# EAGLE design what-the-frequency-mk-1 (EAGLE 6.4)
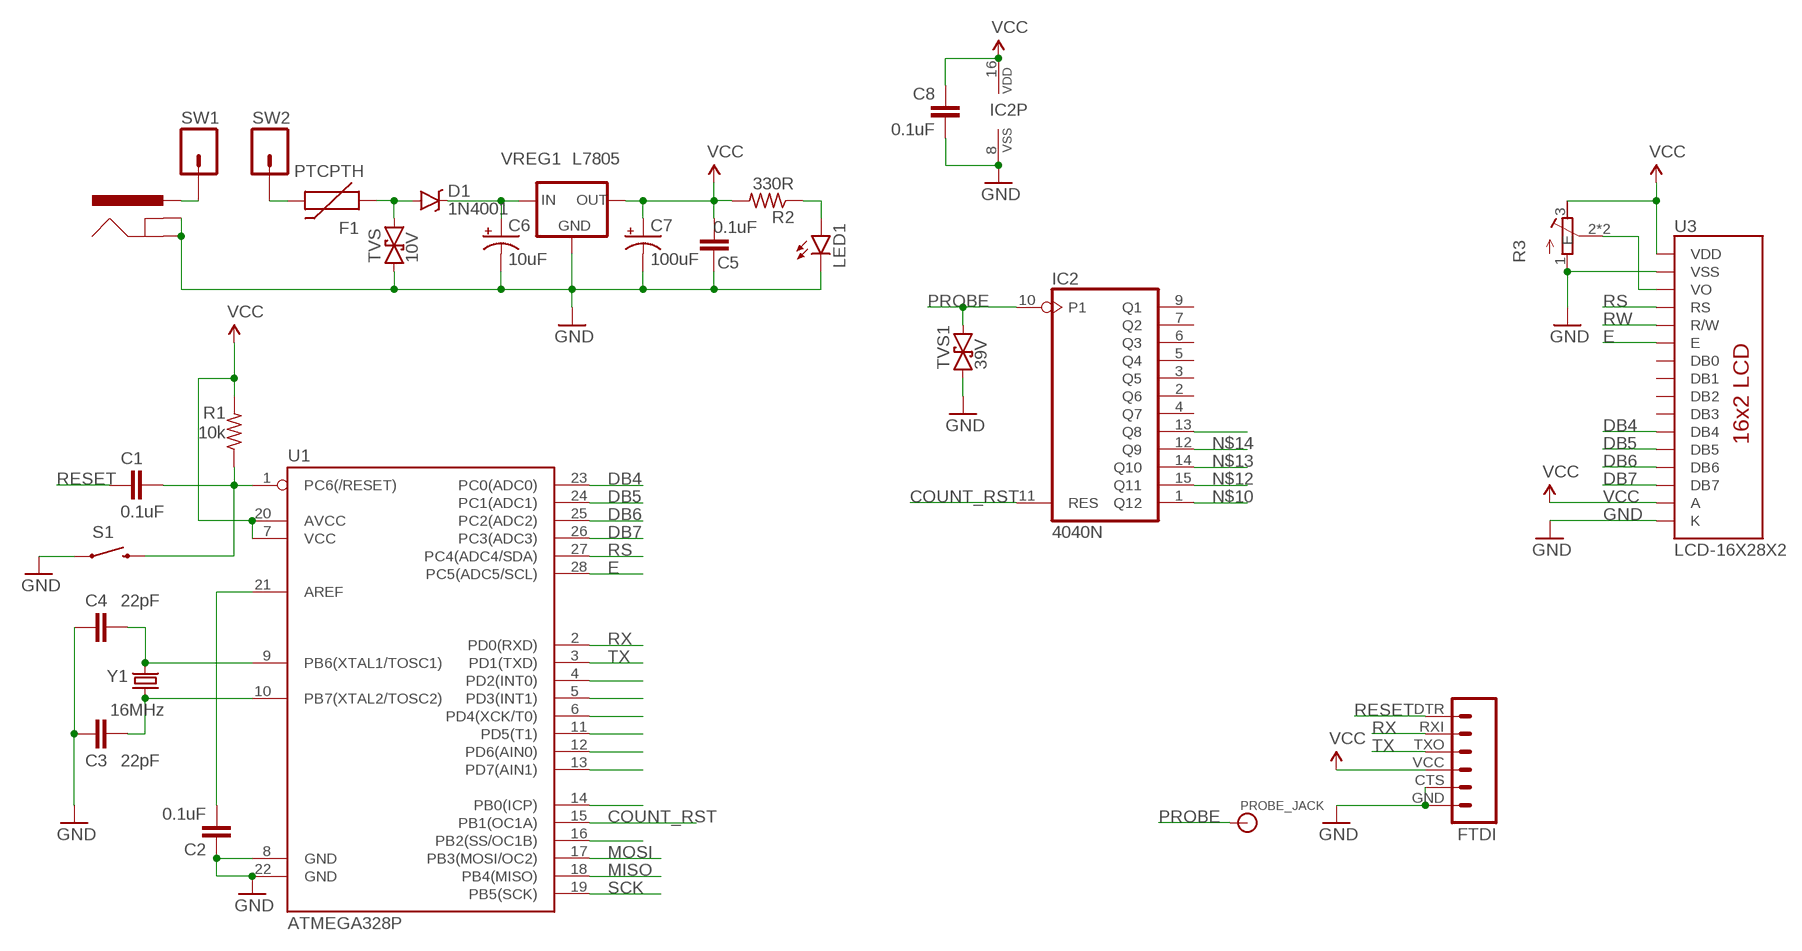
[diagram p0: schematic, sheet 1]

## Parts
C1  0.1uF  CAPACITOR-CERAMIC025-024X044  [C025-024X044]
C2  0.1uF  CAPACITOR-CERAMIC025-024X044  [C025-024X044]
C3  22pF  CAPACITOR-CERAMIC025-024X044  [C025-024X044]
C4  22pF  CAPACITOR-CERAMIC025-024X044  [C025-024X044]
C5  0.1uF  CAPACITOR-CERAMIC025-024X044  [C025-024X044]
C6  10uF  CAPACITOR-POLARIZEDE2.5-5  [E2,5-5]
C7  100uF  CAPACITOR-POLARIZEDE2.5-5  [E2,5-5]
C8  0.1uF  CAPACITOR-CERAMIC025-024X044  [C025-024X044]
D1  1N4001  DIODE-SCHOTTKYDO-41  [DO-41]
F1  PTCPTH  [PTC]
FTDI  FTDI_BASICPTH-TINY-TEXT  [FTDI_TINY_TXT]
IC2  4040N  [DIL16]
J2  POWER_JACKPTH  [POWER_JACK_PTH]
LED1  LED3MM  [LED3MM]
PROBE_JACK  BANANA_CONNPTH-RA  [BANANA-PTH-RA-SAFEWORD]
R1  10k  RESISTORPTH-AXIAL-5.08MM  [AXIAL-PTH-5.08MM]
R2  330R  RESISTORPTH-AXIAL-5.08MM  [AXIAL-PTH-5.08MM]
R3  POTENTIOMETERTHUMBWHEEL-16MM  [POT-THUMBWHEEL]
S1  SWITCH-MOMENTARY-2PTH-RA  [TACTILE-PTH-SIDE]
SW1  M01PTH_2MM  [1X01_2MM]
SW2  M01PTH_2MM  [1X01_2MM]
TVS  10V  TVSDO-41-TVS-BIDIRECTIONAL  [DO-41-TVS]
TVS1  39V  TVSDO-41-TVS-BIDIRECTIONAL  [DO-41-TVS]
U1  ATMEGA328P  ATMEGA328P_PDIP  [DIL28-3]
U3  LCD-16X28X2  [LCD-8X2]
VREG1  L7805  V_REG_78XXTO-92-INLINE  [TO-92-AMMO]
Y1  16MHz  CRYSTALHC49UV  [HC49U-V]

## Nets
COUNT_RST: IC2.11(RES) U1.15(PB1(OC1A))
DB4: U1.23(PC0(ADC0)) U3.11(DB4)
DB5: U1.24(PC1(ADC1)) U3.12(DB5)
DB6: U1.25(PC2(ADC2)) U3.13(DB6)
DB7: U1.26(PC3(ADC3)) U3.14(DB7)
E: U1.28(PC5(ADC5/SCL)) U3.6(E)
GND: C2.1 C3.2 C4.2 C5.1 C6.- C7.- C8.1 FTDI.CTS FTDI.GND IC2.8(VSS) J2.GND J2.GNDBREAK LED1.K(C) R3.1(A) S1.1 TVS1.P$1 TVS.P$1 U1.8(GND) U1.22(GND) U3.1(VSS) U3.16(K) VREG1.2(GND)
MISO: U1.18(PB4(MISO))
MOSI: U1.17(PB3(MOSI/OC2))
N$1: C6.+ D1.C VREG1.1(IN)
N$2: LED1.A R2.P$1
N$3: J2.PWR SW1.1
N$4: D1.A F1.P$1 TVS.P$2
N$5: F1.P$2 SW2.1
N$6: C4.1 U1.9(PB6(XTAL1/TOSC1)) Y1.2
N$7: C3.1 U1.10(PB7(XTAL2/TOSC2)) Y1.1
N$8: C2.2 U1.21(AREF)
N$9: R3.2(S) R3.2@1(S) U3.3(VO)
N$10: IC2.1(Q12)
N$11: C1.2 R1.P$1 S1.2 U1.1(PC6(/RESET))
N$12: IC2.15(Q11)
N$13: IC2.14(Q10)
N$14: IC2.12(Q9)
N$15: IC2.13(Q8)
N$22: U1.4(PD2(INT0))
N$23: U1.5(PD3(INT1))
N$24: U1.6(PD4(XCK/T0))
N$25: U1.11(PD5(T1))
N$26: U1.12(PD6(AIN0))
N$27: U1.13(PD7(AIN1))
N$28: U1.14(PB0(ICP))
N$29: U1.16(PB2(SS/OC1B))
PROBE: IC2.10(P1) PROBE_JACK.P$1 PROBE_JACK.P$2 TVS1.P$2
RESET: C1.1 FTDI.DTR
RS: U1.27(PC4(ADC4/SDA)) U3.4(RS)
RW: U3.5(R/W)
RX: FTDI.RXI U1.2(PD0(RXD))
SCK: U1.19(PB5(SCK))
TX: FTDI.TXO U1.3(PD1(TXD))
VCC: C5.2 C7.+ C8.2 FTDI.VCC IC2.16(VDD) R1.P$2 R2.P$2 R3.3(E) U1.7(VCC) U1.20(AVCC) U3.2(VDD) U3.15(A) VREG1.3(OUT)
Unconnected: IC2.2(Q6) IC2.3(Q5) IC2.4(Q7) IC2.5(Q4) IC2.6(Q3) IC2.7(Q2) IC2.9(Q1) U3.7(DB0) U3.8(DB1) U3.9(DB2) U3.10(DB3)

## Library data of the parts
C1-C5 C8 = A_butts:CAPACITOR-CERAMIC: CAPACITOR, European symbol
C6 C7 = A_butts:CAPACITOR-POLARIZED: POLARIZED CAPACITOR, American symbol
D1 = A_butts:DIODE-SCHOTTKY: Schottky diodes in SFE's production catalog BAT20J 1A 23V 0.62Vf RB751 120mA 40V 0.37Vf PMEG4005EJ 0.5A 40V 0.42Vf MBRA140 1A 40V 0.5Vf B340A 3A 40V SMA
F1 = A_butts:PTC: Resettable Fuse PTC Resettable Fuse. Spark Fun Electronics SKU : COM-08357
FTDI = A_butts:FTDI_BASIC: FTDI Basic header with labels
IC2 = A_butts:4040: 12-stage binary/ripple COUNTER
J2 = SparkFun-Connectors:POWER_JACK: Power Jack This is the standard 5.5mm barrel jack for power. The PTH is the most common, proven, reliable, footprint. The Slot footprint only works if the mill layer is transmitted to the PCB fab house so be warned. Mating wall wart : TOL-00298 (and others); PROD_ID: PRT-00119
LED1 = A_butts:LED: LEDs Standard schematic elements and footprints for 5mm, 3mm, 1206, and 0603 sized LEDs. 5mm - Spark Fun Electronics SKU : COM-00529 (and others)
PROBE_JACK = A_butts:BANANA_CONN: Through-hole banana jack
R1 R2 = A_butts:RESISTOR: RESISTOR, American symbol
R3 = A_butts:POTENTIOMETER: Trimm resistor
S1 = A_butts:SWITCH-MOMENTARY-2: Various NO switches- pushbuttons, reed, etc
SW1 SW2 = A_butts:M01: Header 1 Standard 1-pin 0.1" header. Use with straight break away headers (SKU : PRT-00116), right angle break away headers (PRT-00553), swiss pins (PRT-00743), machine pins (PRT-00117), and female headers (PRT-00115).
TVS TVS1 = A_butts:TVS: Transient voltage suppressor- prevents ESD on inputs. Ignore package description- MBRA140 is NOT this type of part!!!
U1 = SparkFun-DigitalIC:ATMEGA328P_PDIP: uC used in the Arduino 32kb flash, 1k EEPROM, 2k SRAM This is the through-hole version of this chip.
U3 = A_butts:LCD-16X2: Standard text-only 16x2 parallel input LCD
VREG1 = A_butts:V_REG_78XX: Voltage Regulator Standard 7805 5V regulator. IGO (Input Ground Output). Spark Fun Electronics SKU : COM-00107
Y1 = SparkFun-FreqCtrl:CRYSTAL: Various standard crystals. Proven footprints. Spark Fun Electronics SKU : COM-00534

## Board
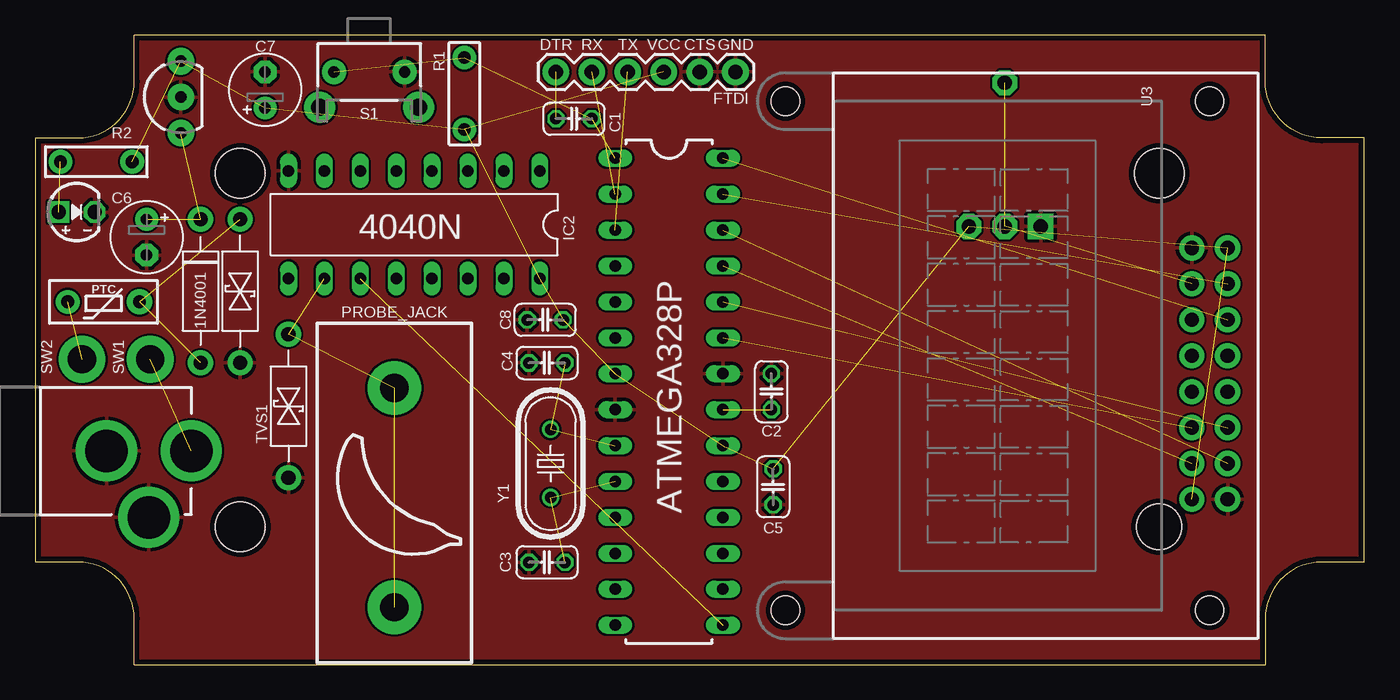
[diagram p1: board, top side]
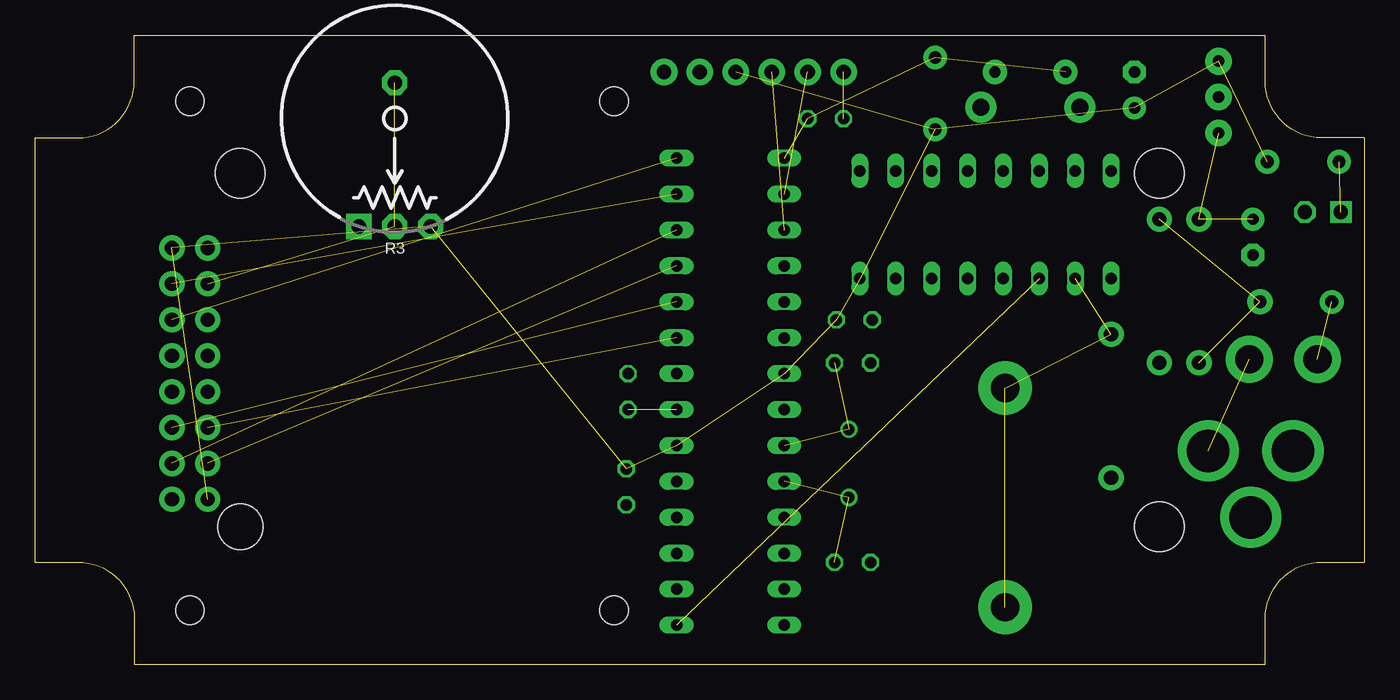
[diagram p2: board, bottom side, seen from below]

Size 94.01 x 44.5 mm. Coordinates in mm from the lower left corner, seen from the top.
Outline: 7,0 87.01,0 87.01,3.26 arc-90 91,7.25 94,7.25 94,37.25 91,37.25 arc-90 87.01,41.24 87.01,44.5 7,44.5 7,41.24 arc-90 3.01,37.25 0,37.25 0,7.25 3.01,7.25 arc-90 7,3.26 7,0
Copper layers (1*16): Top 0.0356mm / dielectric 1.5011mm / Bottom 0.0356mm
Design rules "LaenPCBOrder2": minimum track width 6mil, minimum drill 13mil, track to track 6mil, track to pad 6mil, pad to pad 6mil, via to via 6mil, smd to smd 6mil, copper to edge 15mil, drill to drill 6mil, minimum pad ring 7mil, minimum via ring 7mil, stop-mask expansion 3mil, vias tented up to drill 20mil, thermal gap 10mil
Holes 3.51 mm at 14.5,9.75 14.5,34.75 79.5,34.75
Holes 3.2 mm at 79.5,9.75

### Footprints (pad centres in the part's own frame; a part is rotated, then mirrored left to right if it is on the bottom)
C025-024X044 = drill 0.813 octagon: 1 -1.27,0; 2 1.27,0
E2,5-5 = drill 0.813 pad 1.6: + -1.27,0 | drill 0.813 pad 1.6 octagon: - 1.27,0
DO-41 = drill 1 pad 1.778: A -5.08,0; C 5.08,0
PTC = drill 0.9 pad 1.778: P$1 -2.54,0 | drill 0.9 pad 1.676: P$2 2.54,0
FTDI_TINY_TXT = drill 1.016 pad 1.88: CTS 10.16,0; DTR 0,0; GND 12.7,0; RXI 2.54,0; TXO 5.08,0; VCC 7.62,0
DIL16 = drill 0.813 long: 1 -8.89,-3.81; 2 -6.35,-3.81; 3 -3.81,-3.81; 4 -1.27,-3.81; 5 1.27,-3.81; 6 3.81,-3.81; 7 6.35,-3.81; 8 8.89,-3.81; 9 8.89,3.81; 10 6.35,3.81; 11 3.81,3.81; 12 1.27,3.81; 13 -1.27,3.81; 14 -3.81,3.81; 15 -6.35,3.81; 16 -8.89,3.81
POWER_JACK_PTH = drill 2.997 pad 4.318: GND 0,7.7; GNDBREAK 4.7,10.7; PWR 0,13.7
LED3MM = drill 1 pad 1.524 square: A -1.27,0 | drill 1 pad 1.524 octagon: K 1.27,0
BANANA-PTH-RA-SAFEWORD = drill 2 pad 3.81: P$1 0,0; P$2 15.5,0
AXIAL-PTH-5.08MM = drill 0.9 pad 1.676: P$1 -2.54,0; P$2 2.54,0
POT-THUMBWHEEL = drill 1.016 pad 1.778 square: 1 -2.54,0 | drill 1.016 pad 1.778 octagon: 2 0,0; 2@1 0,10.16; 3 2.54,0
TACTILE-PTH-SIDE = drill 0.8 pad 1.7: 1 -2.5,0; 2 2.5,0 | drill 1.2 pad 2.2: ANCHOR1 -3.5,2.5; ANCHOR2 3.5,2.5
1X01_2MM = drill 2 pad 3.302: 1 0,0
DO-41-TVS = drill 1 pad 1.778: P$1 -5.08,0; P$2 5.08,0
DIL28-3 = drill 0.813 long: 1 -16.51,-3.81; 2 -13.97,-3.81; 3 -11.43,-3.81; 4 -8.89,-3.81; 5 -6.35,-3.81; 6 -3.81,-3.81; 7 -1.27,-3.81; 8 1.27,-3.81; 9 3.81,-3.81; 10 6.35,-3.81; 11 8.89,-3.81; 12 11.43,-3.81; 13 13.97,-3.81; 14 16.51,-3.81; 15 16.51,3.81; 16 13.97,3.81; 17 11.43,3.81; 18 8.89,3.81; 19 6.35,3.81; 20 3.81,3.81; 21 1.27,3.81; 22 -1.27,3.81; 23 -3.81,3.81; 24 -6.35,3.81; 25 -8.89,3.81; 26 -11.43,3.81; 27 -13.97,3.81; 28 -16.51,3.81
LCD-8X2 = drill 1 pad 1.778: 1 -7.62,13.73; 2 -7.62,16.27; 3 -5.08,13.73; 4 -5.08,16.27; 5 -2.54,13.73; 6 -2.54,16.27; 7 0,13.73; 8 0,16.27; 9 2.54,13.73; 10 2.54,16.27; 11 5.08,13.73; 12 5.08,16.27; 13 7.62,13.73; 14 7.62,16.27; 15 10.16,13.73; 16 10.16,16.27 | hole 2: 18,15; -18,15; -18,-15; 18,-15
TO-92-AMMO = drill 0.813 pad 1.88: 1 -2.54,0; 2 0,0; 3 2.54,0
HC49U-V = drill 0.813: 1 -2.413,0; 2 2.413,0

### Placement (x,y rotation side)
C1  38.1,38.61 0 top
C2  52.07,19.3 270 top
C3  36.2,7.24 180 top
C4  36.2,21.34 180 top
C5  52.2,12.57 90 top
C6  7.87,30.23 270 top
C7  16.26,40.64 90 top
C8  36.07,24.38 0 top
D1  11.68,26.42 90 top
F1  4.83,25.65 180 top
FTDI  36.83,41.91 0 top
IC2  26.8,31.11 180 top
J2  -2.67,15.11 270 top
LED1  2.92,32 0 top
PROBE_JACK  25.4,19.56 270 top
R1  30.35,40.39 270 top
R2  4.32,35.56 0 top
R3  68.58,30.99 0 bottom
S1  23.62,41.91 180 top
SW1  8.13,21.59 0 top
SW2  3.3,21.59 270 top
TVS  14.48,26.42 90 top
TVS1  17.91,18.29 90 top
U1  44.83,19.3 270 top
U3  68.07,21.84 270 top
VREG1  10.29,40.13 90 top
Y1  36.45,14.22 90 top

### Tracks (layer width: path | path; a pad name or v marks a point on that pad's centre or on a via)
COUNT_RST  (1 unrouted)
DB4  (1 unrouted)
DB5  (1 unrouted)
DB6  (1 unrouted)
DB7  (1 unrouted)
E  (1 unrouted)
GND
  pour Top: 0,0 0,44.5 94.01,44.5 94.01,0
N$1  (2 unrouted)
N$2  (1 unrouted)
N$3  (1 unrouted)
N$4  (2 unrouted)
N$5  (1 unrouted)
N$6  (2 unrouted)
N$7  (2 unrouted)
N$8  (1 unrouted)
N$9  (2 unrouted)
N$11  (3 unrouted)
PROBE  (3 unrouted)
RESET  (1 unrouted)
RS  (1 unrouted)
RX  (1 unrouted)
TX  (1 unrouted)
VCC  (12 unrouted)